# EAGLE design attiny_pico (EAGLE 7.1.0)
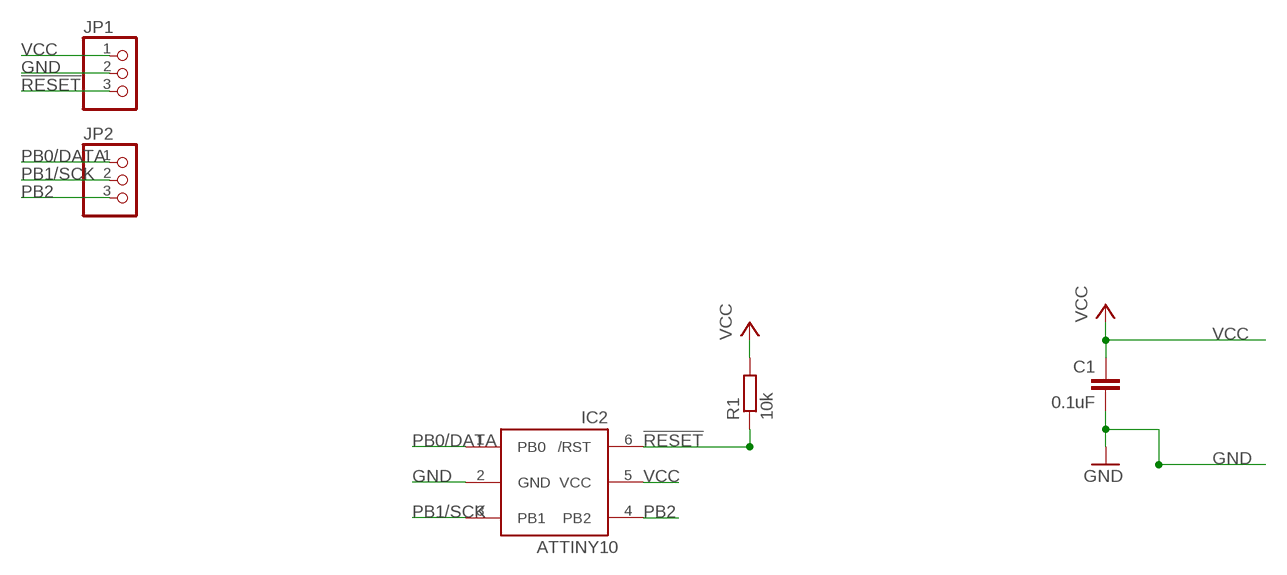
[diagram p0: schematic, sheet 1]

## Parts
C1  0.1uF  C-EUC0805  [C0805]
IC2  ATTINY10  [SOT23-6]
JP1  PINHD-1X3  [1X03]
JP2  PINHD-1X3  [1X03]
R1  10k  R-EU_R0805  [R0805]

## Nets
!RESET: IC2.6(/RST) JP1.3 R1.1
GND [GND]: C1.2 IC2.2(GND) JP1.2
PB0/DATA: IC2.1(PB0) JP2.1
PB1/SCK: IC2.3(PB1) JP2.2
PB2: IC2.4(PB2) JP2.3
VCC [VCC]: C1.1 IC2.5(VCC) JP1.1 R1.2

## Library data of the parts
C1 = resistor:C-EU: CAPACITOR, European symbol
IC2 = adafruit:ATTINY10: ATtiny4/5/9/10 8-bit Microcontroller with 512/1024 Bytes In-System Programmable Flash
JP1 JP2 = pinhead:PINHD-1X3: PIN HEADER
R1 = resistor:R-EU_: RESISTOR, European symbol

## Net classes
0 default: width 0.254 mm, drill 0.508 mm
1 GND: width 0.406 mm, drill 0.508 mm
2 VCC: width 0.406 mm, drill 0.508 mm

## Board
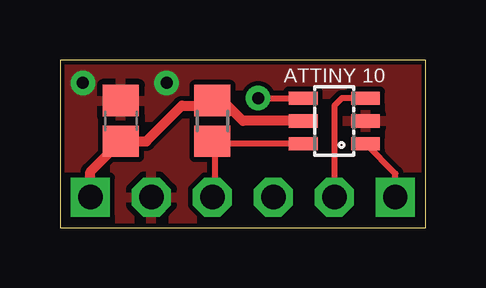
[diagram p1: board, top side]
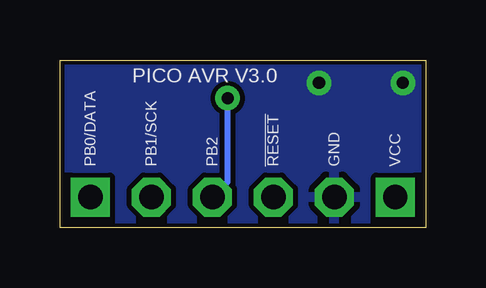
[diagram p2: board, bottom side, seen from below]

Size 15.24 x 6.98 mm. Coordinates in mm from the lower left corner, seen from the top.
Outline: 0,0 15.24,0 15.24,6.98 0,6.98 0,0
Copper layers (1*16): Top 0.035mm / dielectric 1.5mm / Bottom 0.035mm
Design rules "SparkFun *": minimum track width 10mil, minimum drill 20mil, track to track 8mil, track to pad 8mil, pad to pad 8mil, via to via 8mil, smd to smd 8mil, copper to edge 7mil, drill to drill 7mil, minimum pad ring 12mil, minimum via ring 10mil, stop-mask expansion 4mil, vias tented up to drill 25mil, thermal gap 10mil

### Footprints (pad centres in the part's own frame; a part is rotated, then mirrored left to right if it is on the bottom)
C0805 = smd 1.3 x 1.5: 1 -0.85,0; 2 0.85,0
SOT23-6 = smd 0.55 x 1.2: 1 -0.95,-1.3; 2 0,-1.3; 3 0.95,-1.3; 4 0.95,1.3; 5 0,1.3; 6 -0.95,1.3
1X03 = drill 1.016 square: 1 -2.54,0 | drill 1.016 octagon: 2 0,0; 3 2.54,0
R0805 = smd 1.3 x 1.5: 1 -0.85,0; 2 0.85,0

### Placement (x,y rotation side)
C1  2.54,4.44 90 top
IC2  11.43,4.44 90 top
JP1  3.81,1.27 0 top
JP2  11.43,1.27 180 top
R1  6.35,4.44 90 top

### Tracks (layer width: path | path; a pad name or v marks a point on that pad's centre or on a via)
!RESET
  Top 0.254: IC2.6 6.45,3.49 6.45,1.37 JP1.3
  Top 0.406: 6.45,3.49 R1.1
GND  (via drill 0.51 pad 0.51)
  other vias: 0.95,6.03 4.44,6.03
  pour Top: 0,6.98 15.24,6.98 15.24,0 0,0
  pour Bottom: 0,6.98 15.24,6.98 15.24,0 0,0
PB0/DATA
  Top 0.254: JP2.1 13.97,2.26 IC2.1
PB1/SCK
  Top 0.254: IC2.3 11.75,5.39 11.43,5.08 JP2.2
PB2  (via drill 0.51)
  Top 0.254: v8.25,5.4 8.57,5.39 IC2.4
  Bottom 0.254: JP2.3 8.25,1.9 v8.25,5.4
VCC
  Top 0.406: JP1.1 1.27,2.33 C1.1 3.59,3.6 5.08,5.08 6.13,5.08 R1.2 6.57,5.08 6.99,5.08 7.62,4.44 IC2.5

### Text on the board
tNames: ATTINY 10
bNames: PICO AVR V3.0 | VCC | GND | !RESET | PB2 | PB1/SCK | PB0/DATA